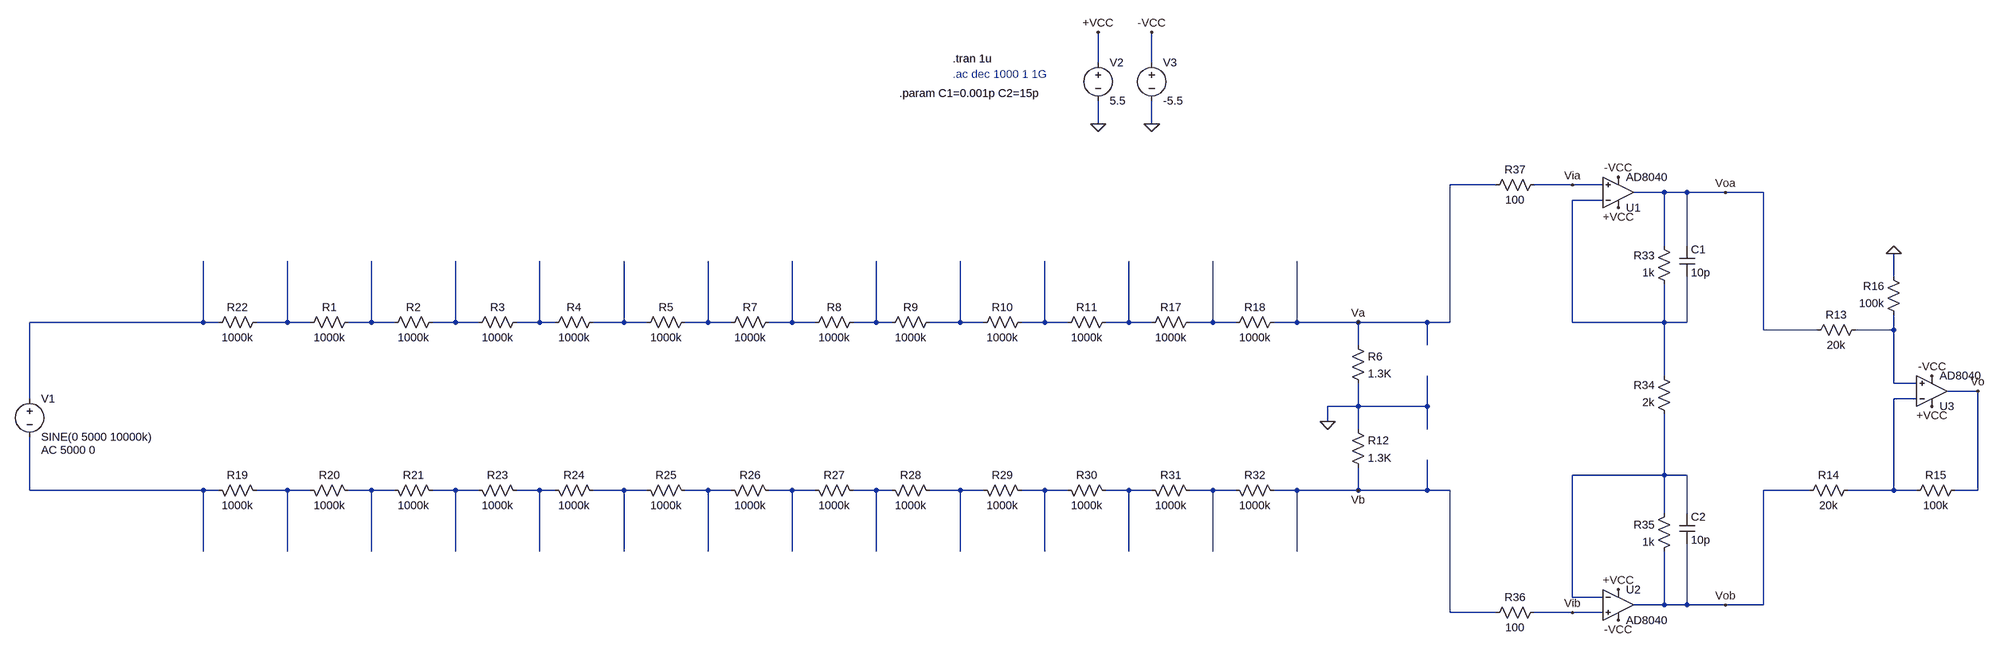
[diagram p0: schematic InputCircuit_Test2.asc]
InputCircuit_Test2.asc, the LTspice schematic file:
Version 4
SHEET 1 2000 692
WIRE 128 -576 128 -640
WIRE 240 -576 240 -640
WIRE 128 -448 128 -496
WIRE 240 -448 240 -496
WIRE 960 -320 864 -320
WIRE 1120 -320 1040 -320
WIRE 1184 -320 1120 -320
WIRE 1312 -304 1248 -304
WIRE 1360 -304 1312 -304
WIRE 1440 -304 1360 -304
WIRE 1520 -304 1440 -304
WIRE 1184 -288 1120 -288
WIRE 1312 -192 1312 -304
WIRE 1360 -192 1360 -304
WIRE 1792 -128 1792 -176
WIRE -1744 -32 -1744 -160
WIRE -1744 -32 -2112 -32
WIRE -1712 -32 -1744 -32
WIRE -1568 -32 -1568 -160
WIRE -1568 -32 -1632 -32
WIRE -1520 -32 -1568 -32
WIRE -1392 -32 -1392 -160
WIRE -1392 -32 -1440 -32
WIRE -1344 -32 -1392 -32
WIRE -1216 -32 -1216 -160
WIRE -1216 -32 -1264 -32
WIRE -1168 -32 -1216 -32
WIRE -1040 -32 -1040 -160
WIRE -1040 -32 -1088 -32
WIRE -1008 -32 -1040 -32
WIRE -864 -32 -864 -160
WIRE -864 -32 -928 -32
WIRE -816 -32 -864 -32
WIRE -688 -32 -688 -160
WIRE -688 -32 -736 -32
WIRE -640 -32 -688 -32
WIRE -512 -32 -512 -160
WIRE -512 -32 -560 -32
WIRE -464 -32 -512 -32
WIRE -336 -32 -336 -160
WIRE -336 -32 -384 -32
WIRE -304 -32 -336 -32
WIRE -160 -32 -160 -160
WIRE -160 -32 -224 -32
WIRE -112 -32 -160 -32
WIRE 16 -32 16 -160
WIRE 16 -32 -32 -32
WIRE 64 -32 16 -32
WIRE 192 -32 192 -160
WIRE 192 -32 144 -32
WIRE 240 -32 192 -32
WIRE 368 -32 368 -160
WIRE 368 -32 320 -32
WIRE 416 -32 368 -32
WIRE 544 -32 544 -160
WIRE 544 -32 496 -32
WIRE 672 -32 544 -32
WIRE 816 -32 672 -32
WIRE 864 -32 864 -320
WIRE 864 -32 816 -32
WIRE 1120 -32 1120 -288
WIRE 1312 -32 1312 -112
WIRE 1312 -32 1120 -32
WIRE 1360 -32 1360 -128
WIRE 1360 -32 1312 -32
WIRE 1520 -16 1520 -304
WIRE 1632 -16 1520 -16
WIRE 1792 -16 1792 -48
WIRE 1792 -16 1712 -16
WIRE 672 16 672 -32
WIRE 816 16 816 -32
WIRE 1312 80 1312 -32
WIRE 1792 96 1792 -16
WIRE 1840 96 1792 96
WIRE 1968 112 1904 112
WIRE -2112 128 -2112 -32
WIRE 1840 128 1792 128
WIRE 672 144 672 96
WIRE 672 144 608 144
WIRE 816 144 816 80
WIRE 816 144 672 144
WIRE 608 176 608 144
WIRE 672 192 672 144
WIRE 816 192 816 144
WIRE 1312 288 1312 160
WIRE 1312 288 1120 288
WIRE 1360 288 1312 288
WIRE -2112 320 -2112 208
WIRE -1744 320 -2112 320
WIRE -1712 320 -1744 320
WIRE -1568 320 -1632 320
WIRE -1520 320 -1568 320
WIRE -1392 320 -1440 320
WIRE -1344 320 -1392 320
WIRE -1216 320 -1264 320
WIRE -1168 320 -1216 320
WIRE -1040 320 -1088 320
WIRE -1008 320 -1040 320
WIRE -864 320 -928 320
WIRE -816 320 -864 320
WIRE -688 320 -736 320
WIRE -640 320 -688 320
WIRE -512 320 -560 320
WIRE -464 320 -512 320
WIRE -336 320 -384 320
WIRE -304 320 -336 320
WIRE -160 320 -224 320
WIRE -112 320 -160 320
WIRE 16 320 -32 320
WIRE 64 320 16 320
WIRE 192 320 144 320
WIRE 240 320 192 320
WIRE 368 320 320 320
WIRE 416 320 368 320
WIRE 544 320 496 320
WIRE 672 320 672 272
WIRE 672 320 544 320
WIRE 816 320 816 256
WIRE 816 320 672 320
WIRE 864 320 816 320
WIRE 1616 320 1520 320
WIRE 1792 320 1792 128
WIRE 1792 320 1696 320
WIRE 1840 320 1792 320
WIRE 1968 320 1968 112
WIRE 1968 320 1920 320
WIRE 1312 368 1312 288
WIRE 1360 368 1360 288
WIRE -1744 448 -1744 320
WIRE -1568 448 -1568 320
WIRE -1392 448 -1392 320
WIRE -1216 448 -1216 320
WIRE -1040 448 -1040 320
WIRE -864 448 -864 320
WIRE -688 448 -688 320
WIRE -512 448 -512 320
WIRE -336 448 -336 320
WIRE -160 448 -160 320
WIRE 16 448 16 320
WIRE 192 448 192 320
WIRE 368 448 368 320
WIRE 544 448 544 320
WIRE 1120 544 1120 288
WIRE 1184 544 1120 544
WIRE 1312 560 1312 448
WIRE 1312 560 1248 560
WIRE 1360 560 1360 432
WIRE 1360 560 1312 560
WIRE 1440 560 1360 560
WIRE 1520 560 1520 320
WIRE 1520 560 1440 560
WIRE 864 576 864 320
WIRE 960 576 864 576
WIRE 1120 576 1040 576
WIRE 1184 576 1120 576
FLAG 672 -32 Va
FLAG 672 320 Vb
FLAG 608 176 0
FLAG 128 -448 0
FLAG 240 -448 0
FLAG 128 -640 +VCC
FLAG 240 -640 -VCC
FLAG 1872 80 -VCC
FLAG 1872 144 +VCC
FLAG 1792 -176 0
FLAG 1968 112 Vo
FLAG 1216 -336 -VCC
FLAG 1216 -272 +VCC
FLAG 1216 592 -VCC
FLAG 1216 528 +VCC
FLAG 1120 -320 Via
FLAG 1120 576 Vib
FLAG 1440 -304 Voa
FLAG 1440 560 Vob
SYMBOL voltage -2112 112 R0
WINDOW 123 24 124 Left 2
WINDOW 39 0 0 Left 0
SYMATTR Value2 AC 5000 0
SYMATTR InstName V1
SYMATTR Value SINE(0 5000 10000k)
SYMBOL res 656 0 R0
SYMATTR InstName R6
SYMATTR Value 1.3K
SYMATTR SpiceLine tol=1 pwr=0.1
SYMBOL res 656 176 R0
SYMATTR InstName R12
SYMATTR Value 1.3K
SYMATTR SpiceLine tol=1 pwr=0.1
SYMBOL voltage 128 -592 R0
WINDOW 123 0 0 Left 0
WINDOW 39 0 0 Left 0
SYMATTR InstName V2
SYMATTR Value 5.5
SYMBOL voltage 240 -592 R0
WINDOW 123 0 0 Left 0
WINDOW 39 0 0 Left 0
SYMATTR InstName V3
SYMATTR Value -5.5
SYMBOL res 1728 -32 R90
WINDOW 0 0 56 VBottom 2
WINDOW 3 32 56 VTop 2
SYMATTR InstName R13
SYMATTR Value 20k
SYMBOL res 1712 304 R90
WINDOW 0 0 56 VBottom 2
WINDOW 3 32 56 VTop 2
SYMATTR InstName R14
SYMATTR Value 20k
SYMBOL res 1936 304 R90
WINDOW 0 0 56 VBottom 2
WINDOW 3 32 56 VTop 2
SYMATTR InstName R15
SYMATTR Value 100k
SYMBOL res 1808 -32 R180
WINDOW 0 36 76 Left 2
WINDOW 3 36 40 Left 2
SYMATTR InstName R16
SYMATTR Value 100k
SYMBOL res -1616 -48 R90
WINDOW 0 0 56 VBottom 2
WINDOW 3 32 56 VTop 2
SYMATTR InstName R22
SYMATTR Value 1000k
SYMATTR SpiceLine tol=0 pwr=1
SYMBOL res -1424 -48 R90
WINDOW 0 0 56 VBottom 2
WINDOW 3 32 56 VTop 2
SYMATTR InstName R1
SYMATTR Value 1000k
SYMATTR SpiceLine tol=0 pwr=1
SYMBOL res -1248 -48 R90
WINDOW 0 0 56 VBottom 2
WINDOW 3 32 56 VTop 2
SYMATTR InstName R2
SYMATTR Value 1000k
SYMATTR SpiceLine tol=0 pwr=1
SYMBOL res -1072 -48 R90
WINDOW 0 0 56 VBottom 2
WINDOW 3 32 56 VTop 2
SYMATTR InstName R3
SYMATTR Value 1000k
SYMATTR SpiceLine tol=0 pwr=1
SYMBOL res -912 -48 R90
WINDOW 0 0 56 VBottom 2
WINDOW 3 32 56 VTop 2
SYMATTR InstName R4
SYMATTR Value 1000k
SYMATTR SpiceLine tol=0 pwr=1
SYMBOL res -720 -48 R90
WINDOW 0 0 56 VBottom 2
WINDOW 3 32 56 VTop 2
SYMATTR InstName R5
SYMATTR Value 1000k
SYMATTR SpiceLine tol=0 pwr=1
SYMBOL res -544 -48 R90
WINDOW 0 0 56 VBottom 2
WINDOW 3 32 56 VTop 2
SYMATTR InstName R7
SYMATTR Value 1000k
SYMATTR SpiceLine tol=0 pwr=1
SYMBOL res -368 -48 R90
WINDOW 0 0 56 VBottom 2
WINDOW 3 32 56 VTop 2
SYMATTR InstName R8
SYMATTR Value 1000k
SYMATTR SpiceLine tol=0 pwr=1
SYMBOL res -208 -48 R90
WINDOW 0 0 56 VBottom 2
WINDOW 3 32 56 VTop 2
SYMATTR InstName R9
SYMATTR Value 1000k
SYMATTR SpiceLine tol=0 pwr=1
SYMBOL res -16 -48 R90
WINDOW 0 0 56 VBottom 2
WINDOW 3 32 56 VTop 2
SYMATTR InstName R10
SYMATTR Value 1000k
SYMATTR SpiceLine tol=0 pwr=1
SYMBOL res 160 -48 R90
WINDOW 0 0 56 VBottom 2
WINDOW 3 32 56 VTop 2
SYMATTR InstName R11
SYMATTR Value 1000k
SYMATTR SpiceLine tol=0 pwr=1
SYMBOL res 336 -48 R90
WINDOW 0 0 56 VBottom 2
WINDOW 3 32 56 VTop 2
SYMATTR InstName R17
SYMATTR Value 1000k
SYMATTR SpiceLine tol=0 pwr=1
SYMBOL res 512 -48 R90
WINDOW 0 0 56 VBottom 2
WINDOW 3 32 56 VTop 2
SYMATTR InstName R18
SYMATTR Value 1000k
SYMATTR SpiceLine tol=0 pwr=1
SYMBOL res -1616 336 M270
WINDOW 0 32 56 VTop 2
WINDOW 3 0 56 VBottom 2
SYMATTR InstName R19
SYMATTR Value 1000k
SYMATTR SpiceLine tol=0 pwr=1
SYMBOL res -1424 336 M270
WINDOW 0 32 56 VTop 2
WINDOW 3 0 56 VBottom 2
SYMATTR InstName R20
SYMATTR Value 1000k
SYMATTR SpiceLine tol=0 pwr=1
SYMBOL res -1248 336 M270
WINDOW 0 32 56 VTop 2
WINDOW 3 0 56 VBottom 2
SYMATTR InstName R21
SYMATTR Value 1000k
SYMATTR SpiceLine tol=0 pwr=1
SYMBOL res -1072 336 M270
WINDOW 0 32 56 VTop 2
WINDOW 3 0 56 VBottom 2
SYMATTR InstName R23
SYMATTR Value 1000k
SYMATTR SpiceLine tol=0 pwr=1
SYMBOL res -912 336 M270
WINDOW 0 32 56 VTop 2
WINDOW 3 0 56 VBottom 2
SYMATTR InstName R24
SYMATTR Value 1000k
SYMATTR SpiceLine tol=0 pwr=1
SYMBOL res -720 336 M270
WINDOW 0 32 56 VTop 2
WINDOW 3 0 56 VBottom 2
SYMATTR InstName R25
SYMATTR Value 1000k
SYMATTR SpiceLine tol=0 pwr=1
SYMBOL res -544 336 M270
WINDOW 0 32 56 VTop 2
WINDOW 3 0 56 VBottom 2
SYMATTR InstName R26
SYMATTR Value 1000k
SYMATTR SpiceLine tol=0 pwr=1
SYMBOL res -368 336 M270
WINDOW 0 32 56 VTop 2
WINDOW 3 0 56 VBottom 2
SYMATTR InstName R27
SYMATTR Value 1000k
SYMATTR SpiceLine tol=0 pwr=1
SYMBOL res -208 336 M270
WINDOW 0 32 56 VTop 2
WINDOW 3 0 56 VBottom 2
SYMATTR InstName R28
SYMATTR Value 1000k
SYMATTR SpiceLine tol=0 pwr=1
SYMBOL res -16 336 M270
WINDOW 0 32 56 VTop 2
WINDOW 3 0 56 VBottom 2
SYMATTR InstName R29
SYMATTR Value 1000k
SYMATTR SpiceLine tol=0 pwr=1
SYMBOL res 160 336 M270
WINDOW 0 32 56 VTop 2
WINDOW 3 0 56 VBottom 2
SYMATTR InstName R30
SYMATTR Value 1000k
SYMATTR SpiceLine tol=0 pwr=1
SYMBOL res 336 336 M270
WINDOW 0 32 56 VTop 2
WINDOW 3 0 56 VBottom 2
SYMATTR InstName R31
SYMATTR Value 1000k
SYMATTR SpiceLine tol=0 pwr=1
SYMBOL res 512 336 M270
WINDOW 0 32 56 VTop 2
WINDOW 3 0 56 VBottom 2
SYMATTR InstName R32
SYMATTR Value 1000k
SYMATTR SpiceLine tol=0 pwr=1
SYMBOL res 1328 -96 R180
WINDOW 0 36 76 Left 2
WINDOW 3 36 40 Left 2
SYMATTR InstName R33
SYMATTR Value 1k
SYMBOL res 1328 176 R180
WINDOW 0 36 76 Left 2
WINDOW 3 36 40 Left 2
SYMATTR InstName R34
SYMATTR Value 2k
SYMBOL OpAmps\\AD8040 1216 -240 M180
SYMATTR InstName U1
SYMBOL res 1328 352 M0
SYMATTR InstName R35
SYMATTR Value 1k
SYMBOL OpAmps\\AD8040 1216 496 R0
SYMATTR InstName U2
SYMBOL res 1056 560 R90
WINDOW 0 0 56 VBottom 2
WINDOW 3 32 56 VTop 2
SYMATTR InstName R36
SYMATTR Value 100
SYMBOL res 1056 -336 R90
WINDOW 0 0 56 VBottom 2
WINDOW 3 32 56 VTop 2
SYMATTR InstName R37
SYMATTR Value 100
SYMBOL cap 1344 -192 R0
SYMATTR InstName C1
SYMATTR Value 10p
SYMBOL cap 1344 368 R0
SYMATTR InstName C2
SYMATTR Value 10p
SYMBOL OpAmps\\AD8040 1872 176 M180
SYMATTR InstName U3
TEXT -176 -584 Left 2 !.tran 1u
TEXT -176 -552 Left 2 ;.ac dec 1000 1 1G
TEXT -288 -512 Left 2 !.param C1=0.001p C2=15p

The netlist it stands for:
* InputCircuit_Test2.asc
V1 N002 N018 SINE(0 5000 10000k) AC 5000 0
R6 Va 0 1.3K tol=1 pwr=0.1
R12 0 Vb 1.3K tol=1 pwr=0.1
V2 +VCC 0 5.5
V3 -VCC 0 -5.5
R13 N015 Voa 20k
R14 N016 Vob 20k
R15 Vo N016 100k
R16 N015 0 100k
R22 N003 N002 1000k tol=0 pwr=1
R1 N004 N003 1000k tol=0 pwr=1
R2 N005 N004 1000k tol=0 pwr=1
R3 N006 N005 1000k tol=0 pwr=1
R4 N007 N006 1000k tol=0 pwr=1
R5 N008 N007 1000k tol=0 pwr=1
R7 N009 N008 1000k tol=0 pwr=1
R8 N010 N009 1000k tol=0 pwr=1
R9 N011 N010 1000k tol=0 pwr=1
R10 N012 N011 1000k tol=0 pwr=1
R11 N013 N012 1000k tol=0 pwr=1
R17 N014 N013 1000k tol=0 pwr=1
R18 Va N014 1000k tol=0 pwr=1
R19 N019 N018 1000k tol=0 pwr=1
R20 N020 N019 1000k tol=0 pwr=1
R21 N021 N020 1000k tol=0 pwr=1
R23 N022 N021 1000k tol=0 pwr=1
R24 N023 N022 1000k tol=0 pwr=1
R25 N024 N023 1000k tol=0 pwr=1
R26 N025 N024 1000k tol=0 pwr=1
R27 N026 N025 1000k tol=0 pwr=1
R28 N027 N026 1000k tol=0 pwr=1
R29 N028 N027 1000k tol=0 pwr=1
R30 N029 N028 1000k tol=0 pwr=1
R31 N030 N029 1000k tol=0 pwr=1
R32 Vb N030 1000k tol=0 pwr=1
R33 N001 Voa 1k
R34 N017 N001 2k
XU1 Via N001 +VCC -VCC Voa AD8040  ; pins In+ In- V+ V- OUT
R35 N017 Vob 1k
XU2 Vib N017 +VCC -VCC Vob AD8040  ; pins In+ In- V+ V- OUT
R36 Vib Vb 100
R37 Via Va 100
C1 Voa N001 10p
C2 N017 Vob 10p
XU3 N015 N016 +VCC -VCC Vo AD8040  ; pins In+ In- V+ V- OUT
.tran 1u
* .ac dec 1000 1 1G
.param C1=0.001p C2=15p
.backanno
.end